# EAGLE schematic WiFiSensorII (EAGLE 7.2.0)
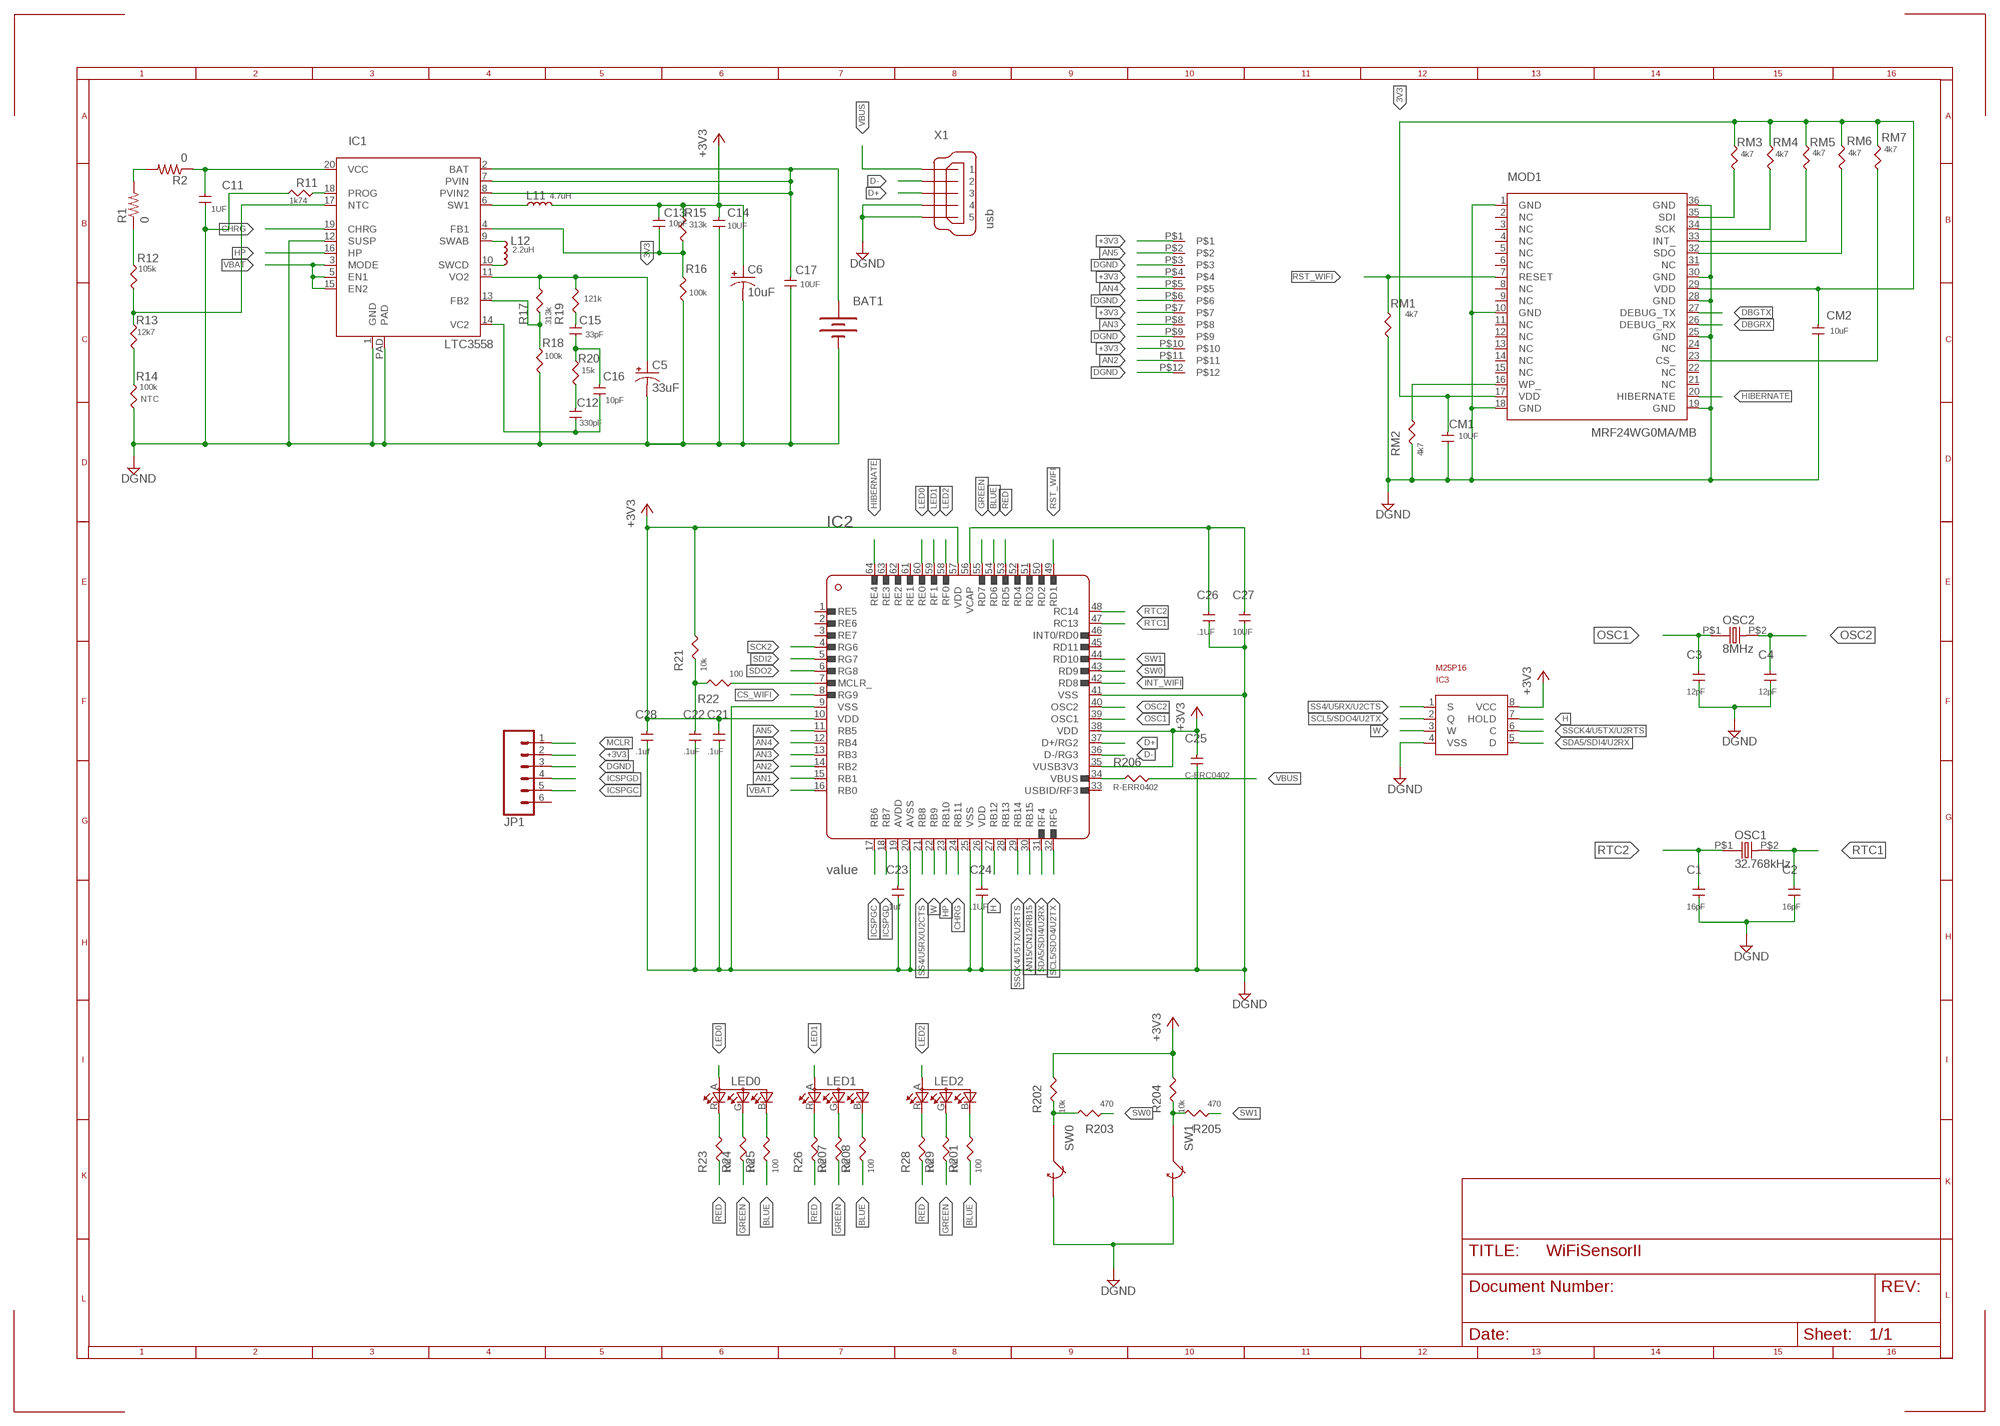
[diagram p0: schematic, sheet 1]

## Parts
BAT1  BATTERY245PTH  [BATTCON_245MM_PTH]
C1  16pF  C-ERC0402  [C0402]
C2  16pF  C-ERC0402  [C0402]
C3  12pF  C-ERC0402  [C0402]
C4  12pF  C-ERC0402  [C0402]
C5  33uF  CPOL-USB  [PANASONIC_B]
C6  10uF  CPOL-USB  [PANASONIC_B]
C11  1UF  C-ERC0402  [C0402]
C12  330pF  C-ERC0402  [C0402]
C13  10pF  C-ERC0402  [C0402]
C14  10UF  C-ER  [C0805]
C15  33pF  C-ERC0402  [C0402]
C16  10pF  C-ERC0402  [C0402]
C17  10UF  C-ER  [C0805]
C21  .1uF  C-ERC0402  [C0402]
C22  .1uF  C-ERC0402  [C0402]
C23  .1uf  C-ERC0402  [C0402]
C24  .1UF  C-ERC0402  [C0402]
C25  C-ERC0402  [C0402]
C26  .1UF  C-ERC0402  [C0402]
C27  10UF  C-ER  [C0805]
C28  .1uf  C-ERC0402  [C0402]
CM1  10UF  C-ER  [C0805]
CM2  10uF  C-ER  [C0805]
IC1  LTC3558  [QFN20]
IC2  PICMX32695F512H  [TQFP64]
IC3  M25P16  [VDFPN8]
JP1  M06LOCK  [1X06_LOCK]
L11  4.7uH  L-ER  [L3010]
L12  2.2uH  L-ER  [L3010]
LED0  1X1RGB  [1X1]
LED1  1X1RGB  [1X1]
LED2  1X1RGB  [1X1]
MOD1  MRF24WG0MA/MB  [MRF24]
OSC1  32.768kHz  ECX32  [ECX39]
OSC2  8MHz  CX532  [CX532]
R1  0  R-US_R1206  [R1206]
R2  0  R-US_R1206  [R1206]
R11  1k74  R-ERR0402  [R0402]
R12  105k  R-ERR0402  [R0402]
R13  12k7  R-ERR0402  [R0402]
R14  100k  R-ERR0402  [R0402]
R15  313k  R-ERR0402  [R0402]
R16  100k  R-ERR0402  [R0402]
R17  313k  R-ERR0402  [R0402]
R18  100k  R-ERR0402  [R0402]
R19  121k  R-ERR0402  [R0402]
R20  15k  R-ERR0402  [R0402]
R21  10k  R-ERR0402  [R0402]
R22  100  R-ERR0402  [R0402]
R23  100  R-ERR0402  [R0402]
R24  100  R-ERR0402  [R0402]
R25  100  R-ERR0402  [R0402]
R26  100  R-ERR0402  [R0402]
R28  100  R-ERR0402  [R0402]
R29  100  R-ERR0402  [R0402]
R201  100  R-ERR0402  [R0402]
R202  10k  R-ERR0402  [R0402]
R203  470  R-ERR0402  [R0402]
R204  10k  R-ERR0402  [R0402]
R205  470  R-ERR0402  [R0402]
R206  R-ERR0402  [R0402]
R207  100  R-ERR0402  [R0402]
R208  100  R-ERR0402  [R0402]
RM1  4k7  R-ERR0402  [R0402]
RM2  4k7  R-ERR0402  [R0402]
RM3  4k7  R-ERR0402  [R0402]
RM4  4k7  R-ERR0402  [R0402]
RM5  4k7  R-ERR0402  [R0402]
RM6  4k7  R-ERR0402  [R0402]
RM7  4k7  R-ERR0402  [R0402]
SW0  BS3N  [BS3N]
SW1  BS3N  [BS3N]
U$11  12_127  [12-127]
X1  usb  MINI-USB-UX60A-MB-5ST  [UX60A-MB-5ST]

## Nets
3V3: C5.+ CM1.2 CM2.2 IC1.11(VO2) MOD1.17(VDD) MOD1.29(VDD) R17.2 R19.2 RM3.2 RM4.2 RM5.2 RM6.2 RM7.2
+3V3: C6.+ C13.2 C14.2 C21.2 C23.2 C25.2 C28.2 IC2.10(VDD) IC2.19(AVDD) IC2.35(VUSB3V3) IC2.38(VDD) IC2.57(VDD) IC3.8(VCC) JP1.2 L11.P$2 R15.2 R21.2 R202.2 R204.2 U$11.P$1 U$11.P$4 U$11.P$7 U$11.P$10
AN1: IC2.15(RB1)
AN2: IC2.14(RB2) U$11.P$11
AN3: IC2.13(RB3) U$11.P$8
AN4: IC2.12(RB4) U$11.P$5
AN5: IC2.11(RB5) U$11.P$2
AN15/CN12/RB15: IC2.30(RB15)
BLUE: IC2.54(RD6) R25.1 R201.1 R208.1
CHRG: IC1.19(CHRG) IC2.24(RB11)
CS_WIFI: IC2.8(RG9) MOD1.23(CS_) RM7.1
D+: IC2.37(D+/RG2) X1.3
D-: IC2.36(D-/RG3) X1.2
DBGRX: MOD1.26(DEBUG_RX)
DBGTX: MOD1.27(DEBUG_TX)
DGND: BAT1.2(-) C1.1 C2.1 C3.1 C4.1 C5.- C6.- C11.1 C14.1 C17.1 C21.1 C22.1 C23.1 C24.1 C25.1 C26.1 C27.1 C28.1 CM1.1 CM2.1 IC1.1(GND) IC1.12(SUSP) IC1.PAD IC2.9(VSS) IC2.20(AVSS) IC2.25(VSS) IC2.41(VSS) IC3.4(VSS) JP1.3 MOD1.1(GND) MOD1.10(GND) MOD1.18(GND) MOD1.19(GND) MOD1.25(GND) MOD1.28(GND) MOD1.30(GND) MOD1.36(GND) R11.2 R14.1 R16.1 R18.1 RM1.1 RM2.1 SW0.2 SW1.2 U$11.P$3 U$11.P$6 U$11.P$9 U$11.P$12 X1.4 X1.5
GREEN: IC2.55(RD7) R24.1 R29.1 R207.1
H: IC2.27(RB12) IC3.7(HOLD)
HIBERNATE: IC2.64(RE4) MOD1.20(HIBERNATE)
HP: IC1.16(HP) IC2.23(RB10)
ICSPGC: IC2.17(RB6) JP1.5
ICSPGD: IC2.18(RB7) JP1.4
INT_WIFI: IC2.42(RD8) MOD1.33(INT_) RM5.1
LED0: IC2.60(RE0) LED0.A(A2)
LED1: IC2.59(RF1) LED1.A(A2)
LED2: IC2.58(RF0) LED2.A(A2)
MCLR: C22.2 JP1.1 R21.1 R22.2
N$1: R1.1 R12.2
N$2: IC1.18(PROG) R11.1
N$3: C11.2 IC1.20(VCC) R2.1
N$4: IC1.17(NTC) R12.1 R13.2
N$5: R13.1 R14.2
N$6: IC1.13(FB2) R17.1 R18.2
N$13: IC1.9(SWAB) L12.P$1
N$14: IC1.10(SWCD) L12.P$2
N$15: IC1.6(SW1) L11.P$1
N$18: C15.2 R19.1
N$19: C15.1 C16.2 R20.2
N$20: C12.2 R20.1
N$21: C12.1 C16.1 IC1.14(VC2)
N$24: IC2.34(VBUS) R206.1
N$25: IC2.7(MCLR_) R22.1
N$26: R202.1 R203.2 SW0.1
N$29: C24.2 IC2.26(VDD)
N$31: C26.2 C27.2 IC2.56(VCAP)
N$33: R204.1 R205.2 SW1.1
N$34: LED0.R(CRED) R23.2
N$40: LED0.G(CBLUE) R24.2
N$41: MOD1.16(WP_) RM2.2
N$42: LED0.B(CGREEN) R25.2
N$43: LED1.R(CRED) R26.2
N$44: LED1.G(CBLUE) R207.2
N$45: LED1.B(CGREEN) R208.2
N$46: LED2.R(CRED) R28.2
N$47: LED2.G(CBLUE) R29.2
N$48: LED2.B(CGREEN) R201.2
N$49: C13.1 IC1.4(FB1) R15.1 R16.2
OSC1: C3.2 IC2.39(OSC1) OSC2.P$1
OSC2: C4.2 IC2.40(OSC2) OSC2.P$2
RED: IC2.53(RD5) R23.1 R26.1 R28.1
RST_WIFI: IC2.49(RD1) MOD1.7(RESET) RM1.2
RTC1: C2.2 IC2.47(RC13) OSC1.P$2
RTC2: C1.2 IC2.48(RC14) OSC1.P$1
SCK2: IC2.4(RG6) MOD1.34(SCK) RM4.1
SCL5/SDO4/U2TX: IC2.32(RF5) IC3.2(Q)
SDA5/SDI4/U2RX: IC2.31(RF4) IC3.5(D)
SDI2: IC2.5(RG7) MOD1.32(SDO) RM6.1
SDO2: IC2.6(RG8) MOD1.35(SDI) RM3.1
SS4/U5RX/U2CTS: IC2.21(RB8) IC3.1(S)
SSCK4/U5TX/U2RTS: IC2.29(RB14) IC3.6(C)
SW0: IC2.43(RD9) R203.1
SW1: IC2.44(RD10) R205.1
VBAT: BAT1.3(+) C17.2 IC1.2(BAT) IC1.3(MODE) IC1.5(EN1) IC1.7(PVIN) IC1.8(PVIN2) IC1.15(EN2) IC2.16(RB0)
VBUS: R1.2 R2.2 R206.2 X1.1
W: IC2.22(RB9) IC3.3(W)
Unconnected: IC2.1(RE5) IC2.2(RE6) IC2.3(RE7) IC2.28(RB13) IC2.33(USBID/RF3) IC2.45(RD11) IC2.46(INT0/RD0) IC2.50(RD2) IC2.51(RD3) IC2.52(RD4) IC2.61(RE1) IC2.62(RE2) IC2.63(RE3) JP1.6 MOD1.2(NC) MOD1.3(NC) MOD1.4(NC) MOD1.5(NC) MOD1.6(NC) MOD1.8(NC) MOD1.9(NC) MOD1.11(NC) MOD1.12(NC) MOD1.13(NC) MOD1.14(NC) MOD1.15(NC) MOD1.21(NC) MOD1.22(NC) MOD1.24(NC) MOD1.31(NC)

## Library data of the parts
BAT1 = SparkFun:BATTERY: Battery Holders Various common sizes : AA, AAA, 20mm coin cell and 12mm coin cell.
C1-C4 C11-C17 C21-C28 CM1 CM2 = rcl:C-ER
C5 C6 = rcl:CPOL-US: POLARIZED CAPACITOR, American symbol
IC1 = linear-technology:LTC3558
IC2 = microchip:PICMX32695F512H
IC3 = st-microelectronics:M25P16
JP1 = SparkFun:M06: Header 6 Standard 6-pin 0.1" header. Use with straight break away headers (SKU : PRT-00116), right angle break away headers (PRT-00553), swiss pins (PRT-00743), machine pins (PRT-00117), and female headers (PRT-00115). Molex polarized connector foot print use with SKU : PRT-08094 with associated crimp pins and housings. NOTES ON THE VARIANTS LOCK and LOCK_LONGPADS... This footprint was designed to help hold the alignment of a through-hole component (i.e. 6-pin header) while soldering it into place. You may notice that each hole has been shifted either up or down by 0.005 of an inch from it's more standard position (which is a perfectly straight line). This slight alteration caused the pins (the squares in the middle) to touch the edges of the holes. Because they are alternating, it causes a "brace" to hold the component in place. 0.005 has proven to be the perfect amount of "off-center" position when using our standard breakaway headers. Although looks a little odd when you look at the bare footprint, once you have a header in there, the alteration is very hard to notice. Also, if you push a header all the way into place, it is covered up entirely on the bottom side. This idea of altering the position of holes to aid alignment will be further integrated into the Sparkfun Library for other footprints. It can help hold any component with 3 or more connection pins.
L11 L12 = rcl:L-ER
LED0 LED1 LED2 = led:1X1RGB
MOD1 = microchip:MRF24WG0MA/MB
OSC1 = crystal:ECX32; DIGIPART: XC1658CT-ND
OSC2 = crystal:CX532; DIGIPART: XC1658CT-ND
R1 R2 = rcl:R-US_: RESISTOR, American symbol
R11-R13 R15-R26 R28 R29 R201-R208 RM1-RM7 = rcl:R-ER
R14 = rcl:R-ER; NTC: NTC
SW0 SW1 = switch-omron:BS3N
U$11 = con-molex:12_127
X1 = con-hirose:MINI-USB-: MINI USB Connector Source: http://www.hirose.co.jp/cataloge_hp/e24000019.pdf